# Altium project LevelShifter.PrjPcb
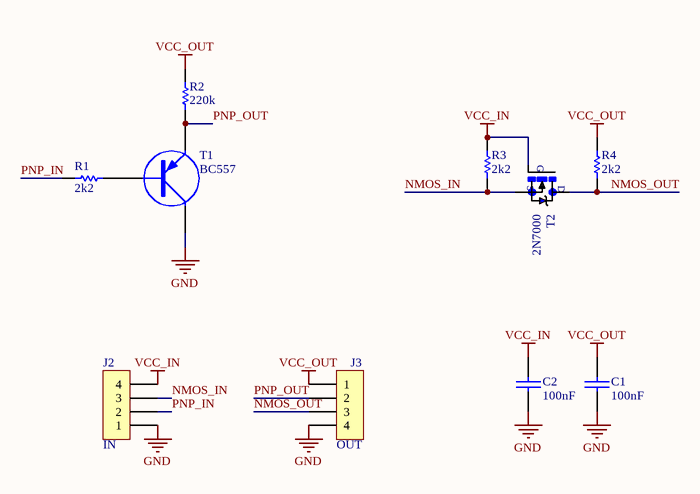
[diagram p0: LevelShifter_SCH.SchDoc]
1 sheet, 10 parts. Net scope: global (net labels, ports and power ports of the same name join across sheets).
Board file: LevelShifter_PCB.PcbDoc

## Sheet LevelShifter_SCH.SchDoc
size A4

### Parts
C1  100nF  [0805]
C2  100nF  [0805]
J2  IN  [SIP4]
J3  OUT  [SIP4]
R1  2k2  [0805]
R2  220k  [0805]
R3  2k2  [0805]
R4  2k2  [0805]
T1  BC557  [TO92]
T2  2N7000  [*TO-92]

### Nets
GND: C1.2 C2.2 J2.1 J3.4 T1.2(C)
VCC_IN: C2.1 J2.4 R3.1 T2.2(G)
VCC_OUT: C1.1 J3.1 R2.1 R4.1
NMOS_IN: J2.3 R3.2 T2.1(S)
NMOS_OUT: J3.3 R4.2 T2.3(D)
PNP_IN: J2.2 R1.1
PNP_OUT: J3.2 R2.2 T1.3(E)
NetR1_2: R1.2 T1.1(B)

### Library data of the parts
C1 C2 = CAP: Value: 100nF; Footprint: SMD 0805
J2 J3 = CON4: Value: Pines Macho; Footprint: Pines Macho
R1-R4 = RES: Footprint: SMD 0805
  R1 R3 R4: Value: 2k2
  R2: Value: 220k
T1 = TRANSISTOR PNP: Value: BC557; Footprint: THT TO92
T2 = 2N7000: MOSFETs- Power and Small Signal 60V 200mA N-Channel No-Cancel/No-Return; MF: STMicroelectronics; MP: 2N7000; SnapEDA_Link: https://www.snapeda.com/parts/2N7000/STMicroelectronics/view-part/?ref=snap; Availability: Unavailable; Package: TO-92 ON Semiconductor; Price: None; Value: *